# Altium schematic sheet Analyzer Connector.SchDoc
size A; SheetNumber: 2; SheetTotal: 5
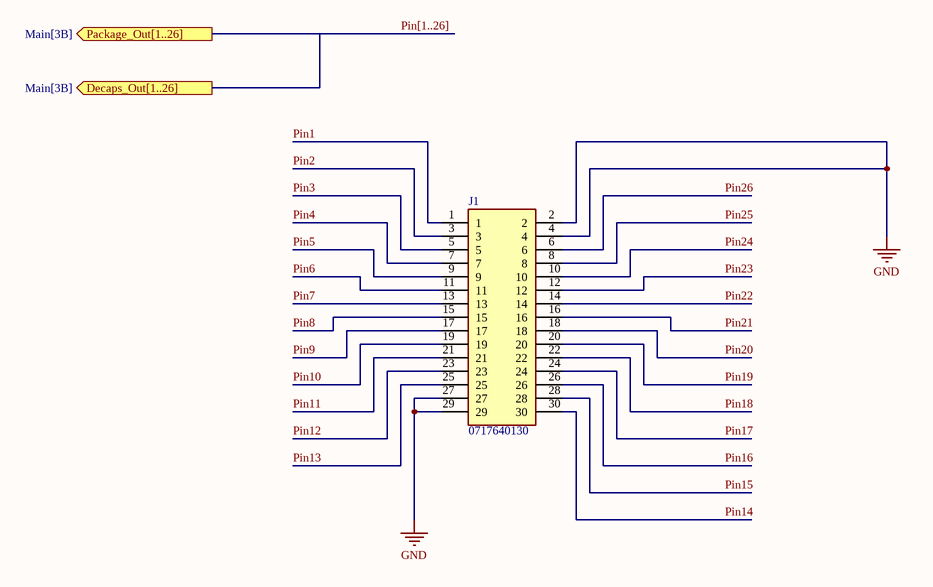
[diagram p0: Analyzer Connector.SchDoc]

## Parts
J1  0717640130  [HDRRA30W64P254_2X15_3810X229X533P]

## Ports
Decaps_Out[1..26] (out, see Main[3B]), Package_Out[1..26] (out, see Main[3B])

## Nets
GND: J1.2 J1.4 J1.27 J1.29
Pin1: J1.1
Pin2: J1.3
Pin3: J1.5
Pin4: J1.7
Pin5: J1.9
Pin6: J1.11
Pin7: J1.13
Pin8: J1.15
Pin9: J1.17
Pin10: J1.19
Pin11: J1.21
Pin12: J1.23
Pin13: J1.25
Pin14: J1.30
Pin15: J1.28
Pin16: J1.26
Pin17: J1.24
Pin18: J1.22
Pin19: J1.20
Pin20: J1.18
Pin21: J1.16
Pin22: J1.14
Pin23: J1.12
Pin24: J1.10
Pin25: J1.8
Pin26: J1.6

## Buses and harness runs
bus Pin[1..26] = port Decaps_Out[1..26] = port Package_Out[1..26]

## Library data of the parts
J1 = 0717640130: Connector; Manufacturer_Name: Molex; Datasheet Link: https://www.molex.com/pdm_docs/sd/717640130_sd.pdf; Height: 5.33mm; Manufacturer_Part_Number: 0717640130; Mouser Part Number: N/A; Mouser Price/Stock: https://www.mouser.com/Search/Refine.aspx?Keyword=N%2FA; Arrow Part Number: 0717640130; Arrow Price/Stock: https://www.arrow.com/en/products/0717640130/molex